# Altium project Battman.PrjPcb (part 3 of 3)

## Sheet Singlepath.SchDoc
size A4; SheetNumber: 10; SheetTotal: 10
Used 2 times, as channels PowerPath/SinglePath1, PowerPath/SinglePath2. Parts and nets are listed once, with the designators drawn on the sheet.
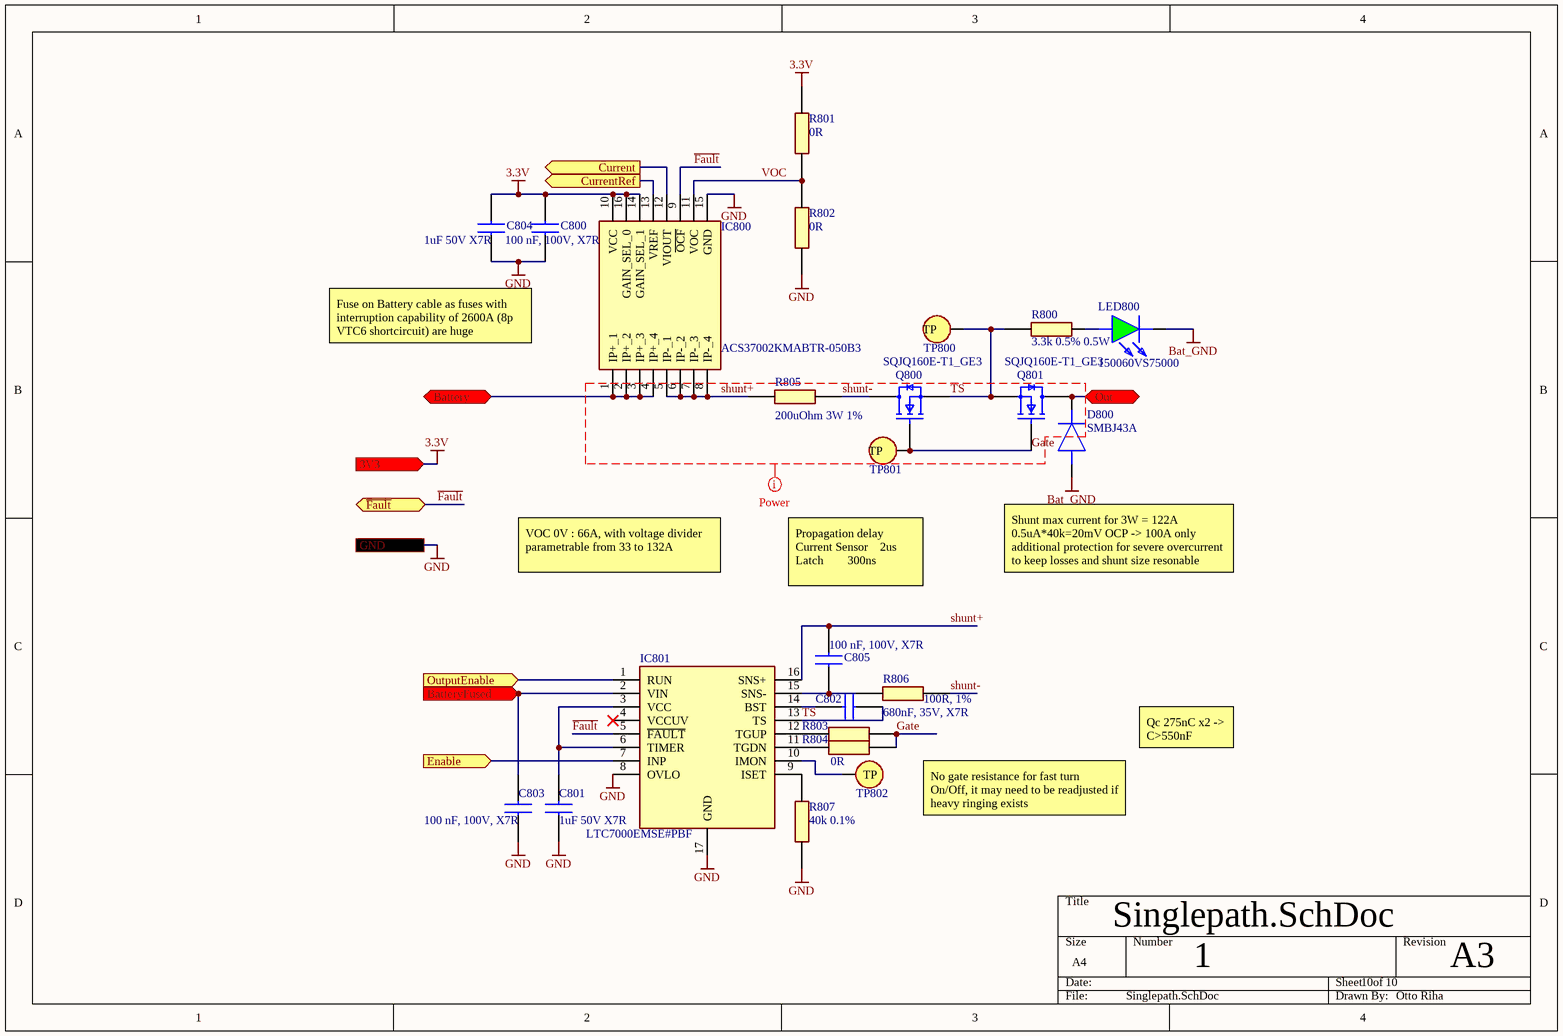
[diagram p9: Singlepath.SchDoc]

### Parts
C800  100 nF, 100V, X7R  [MAJx16]
C801  1uF 50V X7R  [CAPC1608X90N]
C802  680nF, 35V, X7R  [CAPC1608X90N]
C803  100 nF, 100V, X7R  [MAJx16]
C804  1uF 50V X7R  [CAPC1608X90N]
C805  100 nF, 100V, X7R  [MAJx16]
D800  SMBJ43A  [DIOM5436X244N]
IC800  ACS37002KMABTR-050B3  [SOIC127P1030X265-16N]
IC801  LTC7000EMSE#PBF  [SOP50P490X110-17N]
LED800  150060VS75000  [LEDC1608X80N]
Q800  SQJQ160E-T1_GE3  [SQJQ160ET1_GE3]
Q801  SQJQ160E-T1_GE3  [SQJQ160ET1_GE3]
R800  3.3k 0.5% 0.5W  [ERJP06D1000V]
R801  value 0R  [RESC1608X50N]  (hidden comment: 0Ohm)
R802  value 0R  [RESC1608X50N]  (hidden comment: 0Ohm)
R803  value 0R  [RESC1608X50N]  (hidden comment: 0Ohm)
R804  0Ohm  [RESC1608X50N]  (value not drawn)
R805  200uOhm 3W 1%  [RESC10052X63N]
R806  100R, 1%  [RESC1608X50N]
R807  40k 0.1%  [RESC1608X55N]
TP800  Testpoint  [Testpoint]  (value not drawn)
TP801  Testpoint  [Testpoint]  (value not drawn)
TP802  Testpoint  [Testpoint]  (value not drawn)

### Ports
3V3 (in, see PowerPath[2B], AuxSupply_USB[2D], MCU[1A], PowerPath[1B]), Battery (bidir, see PowerPath[2A], PowerPath[1A]), BatteryFused (in, see PowerPath[2B], PowerPath[1B]), Current (out, see PowerPath[2B]), CurrentRef (out, see PowerPath[2B]), Enable (in, see PowerPath[2B]), GND (see PowerPath[2B], AuxSupply_USB[1C], LTC_Hardware[1D], MCU[1A], PowerPath[1B]), Out (bidir, see PowerPath[2B]), OutputEnable (in, see PowerPath[2B], MCU[3C], PowerPath[2D]), ~{Fault} (bidir, see PowerPath[2B])

### Nets
3.3V: C800.2 C804.2 IC800.10(VCC) IC800.14(GAIN_SEL_1) IC800.16(GAIN_SEL_0) R801.2 ; port 3V3
Bat_GND: D800.2(A) LED800.1(K)
GND: C800.1 C801.1 C803.1 C804.1 IC800.15(GND) IC801.8(OVLO) IC801.17(GND) R802.1 R807.1 ; port GND
Battery: IC800.1(IP+_1) IC800.2(IP+_2) IC800.3(IP+_3) IC800.4(IP+_4) ; port Battery
BatteryFused: C803.2 IC801.2(VIN) ; port BatteryFused
Current: IC800.12(VIOUT) ; port Current
CurrentRef: IC800.13(VREF) ; port CurrentRef
Enable: IC801.7(INP) ; port Enable
~{Fault}: IC800.9(~{OCF}) IC801.5(~{FAULT}) ; port ~{Fault}
Gate: Q800.1(G) Q801.1(G) R803.2 R804.2 TP801.1(TP)
Out: D800.1(K) Q801.3(D_1) ; port Out
OutputEnable: IC801.1(RUN) ; port OutputEnable
shunt+: C805.2 IC800.5(IP-_1) IC800.6(IP-_2) IC800.7(IP-_3) IC800.8(IP-_4) IC801.16(SNS+) R805.1
shunt-: Q800.3(D_1) R805.2 R806.2
TS: C802.2 IC801.13(TS) Q800.2(S_1) Q801.2(S_1) R800.1 TP800.1(TP)
VOC: IC800.11(VOC) R801.1 R802.2
NetC801_2: C801.2 IC801.3(VCC) IC801.6(TIMER)
NetC802_1: C802.1 IC801.14(BST)
NetC805_1: C805.1 IC801.15(SNS-) R806.1
NetIC801_9: IC801.9(ISET) R807.2
NetIC801_10: IC801.10(IMON) TP802.1(TP)
NetIC801_11: IC801.11(TGDN) R804.1
NetIC801_12: IC801.12(TGUP) R803.1
NetLED800_2: LED800.2(A) R800.2

Not connected (* = marked no-connect by the designer): IC801 4(VCCUV)*

### Channels
PowerPath/SinglePath1: designators end in A; ports 3V3=3.3V Battery=V_Bat BatteryFused=V_Bat_Fused Current=Current1 CurrentRef=CurrRef1 Enable=Enable1 GND=Bat_GND_Fused Out=Out1 OutputEnable=OutputEnable ~{Fault}=~{Fault}
PowerPath/SinglePath2: designators end in B; ports 3V3=3.3V Battery=V_Bat BatteryFused=V_Bat_Fused Current=Current2 CurrentRef=CurrRef2 Enable=Enable2 GND=Bat_GND_Fused Out=Out2 OutputEnable=OutputEnable ~{Fault}=~{Fault}

### Layout directives
net class Batt+: Gate, shunt+, shunt-, TS

### Notes on the sheet
- Fuse on Battery cable as fuses with interruption capability of 2600A (8p VTC6 shortcircuit) are huge
- VOC 0V : 66A, with voltage divider parametrable from 33 to 132A
- Propagation delay
  Current Sensor    2us
  Latch 	      300ns
- (near D800) Shunt max current for 3W = 122A
  0.5uA*40k=20mV OCP -> 100A only additional protection for severe overcurrent to keep losses and shunt size resonable
- Qc 275nC x2 ->
  C>550nF
- No gate resistance for fast turn On/Off, it may need to be readjusted if heavy ringing exists
- 1
- A3
- Otto Riha

### Library data of the parts
C800 C803 C805 = MAJCH168BB7104KTEA01: Capacitor 100nF, 100V, X7R; Manufacturer_Name: TAIYO YUDEN; Datasheet Link: https://ds.yuden.co.jp/TYCOMPAS/or/detail?pn=MAJCH168BB7104KTEA01; Height: 0.8mm; Manufacturer_Part_Number: MAJCH168BB7104KTEA01; Mouser Part Number: 963-MAJCH168BB7104KT; Mouser Price/Stock: https://www.mouser.co.uk/ProductDetail/TAIYO-YUDEN/MAJCH168BB7104KTEA01?qs=ZcfC38r4PovaTBrG0IdezQ%3D%3D; Arrow Part Number: MAJCH168BB7104KTEA01; Arrow Price/Stock: https://www.arrow.com/en/products/majch168bb7104ktea01/taiyo-yuden?utm_currency=USD&region=nac; Supplier 1: Mouser; Supplier Part Number 1: 963-MAJCH168BB7104KT
C801 C804 = 06035C105MAT2A: Capacitor 1uF 50V X7R; Manufacturer_Name: Kyocera AVX; Datasheet Link: https://componentsearchengine.com/Datasheets/1/06031A100FAT2A.pdf; Height: 0.9mm; Manufacturer_Part_Number: 06035C105MAT2A; Mouser Part Number: 581-06035C105MAT2A; Mouser Price/Stock: https://www.mouser.co.uk/ProductDetail/KYOCERA-AVX/06035C105MAT2A?qs=%252BdQmOuGyFcHMsevPtc6OZQ%3D%3D; Value: 1uF
C802 = CGA3E1X7R1V684K080AC: Capacitor 680nF, 35V, X7R; Manufacturer_Name: TDK; Datasheet Link: http://docs-europe.electrocomponents.com/webdocs/14e9/0900766b814e9125.pdf; Height: 0.9mm; Manufacturer_Part_Number: CGA3E1X7R1V684K080AC; Mouser Part Number: 810-CGA3E1X7R1V684KC; Supplier 1: Mouser; Supplier Part Number 1: 810-CGA3E1X7R1V684KC
D800 = SMBJ43A: Diode; Manufacturer_Name: LITTELFUSE; Datasheet Link: https://componentsearchengine.com/Datasheets/2/SMBJ43A.pdf; Height: 2.44mm; Manufacturer_Part_Number: SMBJ43A; Mouser Part Number: 576-SMBJ43A; Mouser Price/Stock: https://www.mouser.co.uk/ProductDetail/Littelfuse/SMBJ43A?qs=zHiv0nsVGmoMbQaEc1ZdvQ%3D%3D; Arrow Part Number: SMBJ43A; Arrow Price/Stock: https://www.arrow.com/en/products/smbj43a/littelfuse?region=nac
IC800 = ACS37002KMABTR-050B3: Integrated Circuit; Manufacturer_Name: Allegro Microsystems; Datasheet Link: https://www.allegromicro.com/-/media/files/datasheets/acs37002-datasheet.ashx?sc_lang=en&hash=FFD236A6D18C7717C5A7906548FB48D2; Height: 2.65mm; Manufacturer_Part_Number: ACS37002KMABTR-050B3; Mouser Part Number: 250-37002KMABTR050B3; Mouser Price/Stock: https://www.mouser.co.uk/ProductDetail/Allegro-MicroSystems/ACS37002KMABTR-050B3?qs=pUKx8fyJudCSE%2FoW6XxDYQ%3D%3D
IC801 = LTC7000EMSE#PBF: Integrated Circuit; Manufacturer_Name: Analog Devices; Datasheet Link: https://www.analog.com/media/en/technical-documentation/data-sheets/ltc7000-7000-1.pdf; Height: 1.1mm; Manufacturer_Part_Number: LTC7000EMSE#PBF; Mouser Part Number: 584-LTC7000EMSEPBF; Mouser Price/Stock: https://www.mouser.co.uk/ProductDetail/Analog-Devices/LTC7000EMSEPBF?qs=BZBei1rCqCABaEvAxqf5Sw%3D%3D; Arrow Part Number: LTC7000EMSE#PBF; Arrow Price/Stock: https://www.arrow.com/en/products/ltc7000emsepbf/analog-devices?region=nac
LED800 = 150060VS75000: LED; Manufacturer_Name: Wurth Elektronik; Datasheet Link: https://componentsearchengine.com/Datasheets/2/150060VS75000.pdf; Height: 0.8mm; Manufacturer_Part_Number: 150060VS75000; Mouser Part Number: 710-150060VS75000; Mouser Price/Stock: https://www.mouser.co.uk/ProductDetail/Wurth-Elektronik/150060VS75000?qs=LlUlMxKIyB1Q1Bi5mQ%2FKLw%3D%3D
Q800 Q801 = SQJQ160E-T1_GE3: MOSFET (N-Channel); Manufacturer_Name: Vishay; Datasheet Link: https://www.vishay.com/docs/63059/sqjq160e.pdf; Height: 1.65mm; Manufacturer_Part_Number: SQJQ160E-T1_GE3; Mouser Part Number: 78-SQJQ160E-T1_GE3; Mouser Price/Stock: https://www.mouser.co.uk/ProductDetail/Vishay-Semiconductors/SQJQ160E-T1_GE3?qs=Wj%2FVkw3K%252BMDBWZlqh0rWDw%3D%3D
R800 = ERJ-P06J332V: Resistor; Manufacturer_Name: Panasonic; Datasheet Link: http://industrial.panasonic.com/cdbs/www-data/pdf/RDA0000/AOA0000C102.pdf; Height: 0.7mm; Manufacturer_Part_Number: ERJ-P06J332V; Mouser Part Number: 667-ERJ-P06J332V; Mouser Price/Stock: https://www.mouser.co.uk/ProductDetail/Panasonic/ERJ-P06J332V?qs=Zyl8A9hlmJrue%2FwxovXuCg%3D%3D; Arrow Part Number: ERJ-P06J332V; Arrow Price/Stock: https://www.arrow.com/en/products/erj-p06j332v/panasonic
R801-R803 = CRCW06030000Z0EC: Resistor; Manufacturer_Name: Vishay; Datasheet Link: http://www.vishay.com/docs/20035/dcrcwe3.pdf; Height: 0.5mm; Manufacturer_Part_Number: CRCW06030000Z0EC; Mouser Part Number: 71-CRCW06030000Z0EC; Mouser Price/Stock: https://www.mouser.co.uk/ProductDetail/Vishay-Dale/CRCW06030000Z0EC?qs=5Vo7YKalRVV5nT3RQodYAA%3D%3D; Arrow Part Number: CRCW06030000Z0EC; Arrow Price/Stock: https://www.arrow.com/en/products/crcw06030000z0ec/vishay?utm_currency=USD&region=nac
R804 = CRCW06030000Z0EC: Resistor; Manufacturer_Name: Vishay; Value: 0R; Datasheet Link: http://www.vishay.com/docs/20035/dcrcwe3.pdf; Height: 0.5mm; Manufacturer_Part_Number: CRCW06030000Z0EC; Mouser Part Number: 71-CRCW06030000Z0EC; Mouser Price/Stock: https://www.mouser.co.uk/ProductDetail/Vishay-Dale/CRCW06030000Z0EC?qs=5Vo7YKalRVV5nT3RQodYAA%3D%3D; Arrow Part Number: CRCW06030000Z0EC; Arrow Price/Stock: https://www.arrow.com/en/products/crcw06030000z0ec/vishay?utm_currency=USD&region=nac
R805 = PU3921FKN130U2L: Resistor; Manufacturer_Name: YAGEO; Datasheet Link: https://www.yageo.com/upload/media/product/app/datasheet/rchip/pyu-pu_51_rohs_l.pdf; Height: 0.63mm; Manufacturer_Part_Number: PU3921FKN130U2L; Mouser Part Number: 603-PU3921FKN130U2L; Mouser Price/Stock: https://www.mouser.co.uk/ProductDetail/YAGEO/PU3921FKN130U2L?qs=Yv%2FzsQ5pz3Hao%2Fr%2FiAcpvw%3D%3D; Arrow Part Number: PU3921FKN130U2L; Arrow Price/Stock: https://www.arrow.com/en/products/pu3921fkn130u2l/yageo?utm_currency=USD&region=nac
R806 = CRCW0603100RFKEA: Resistor 100R, 1%; Manufacturer_Name: Vishay; Datasheet Link: http://www.vishay.com/docs/20035/dcrcwe3.pdf; Height: 0.5mm; Manufacturer_Part_Number: CRCW0603100RFKEA; Mouser Part Number: 71-CRCW0603-100-E3; Mouser Price/Stock: https://www.mouser.co.uk/ProductDetail/Vishay-Dale/CRCW0603100RFKEA?qs=90AHS1y%2FsidGWjjxZAupKg%3D%3D; Arrow Part Number: CRCW0603100RFKEA; Arrow Price/Stock: https://www.arrow.com/en/products/crcw0603100rfkea/vishay?utm_currency=USD&region=europe; Supplier 1: Mouser; Supplier Part Number 1: 71-CRCW0603-100-E3; Value: 100R
R807 = AT0603BRD0740KL: Resistor; Manufacturer_Name: YAGEO; Datasheet Link: https://pt.mouser.com/datasheet/2/447/PYu_AT_51_RoHS_L_6-3003058.pdf; Height: 0.55mm; Manufacturer_Part_Number: AT0603BRD0740KL; Mouser Part Number: 603-AT0603BRD0740KL

## Nets that join several sheets
3.3V: Main (J11.2), AuxSupply_USB (11 pins), MCU (16 pins), PowerPath (C900.1 IC900.8 R900.1), PowerPath/SinglePath1 (6 pins), PowerPath/SinglePath2 (6 pins)
5V: AuxSupply_USB (C418.2 PS401.7 PS401.8_9 TP407.1), MCU (C709.2 C710.2 IC701.8)
5V_USB: Main (J10.A4_B9 J10.B4_A9), AuxSupply_USB (9 pins)
Bat_GND: Main (12 pins), PowerPath/SinglePath1 (D800A.2 LED800A.1), PowerPath/SinglePath2 (D800B.2 LED800B.1)
Bat_GND_Fused: Main (6 pins), LTC_Hardware (5 pins), AuxSupply_USB (31 pins), LTC_Soft (12 pins), MCU (33 pins), PowerPath (C900.2 IC900.1 IC900.2 IC900.4), PowerPath/SinglePath1 (9 pins), PowerPath/SinglePath2 (9 pins)
CAN_GND: Main (J8.3 J8.4 J9.3 J9.4), AuxSupply_USB (C418.1 PS401.10_11 PS401.12 TP408.1), MCU (5 pins)
Cell0: cell_inputfilter (F100.2), CellFilter/CellFilter1 (5 pins), CellFilter/CellFilter2 (C200B.1 C201B.1), CellFilter/CellFilter3 (C200C.1 C201C.1), CellFilter/CellFilter4 (C200D.1 C201D.1), CellFilter/CellFilter5 (C200E.1 C201E.1), CellFilter/CellFilter6 (C200F.1 C201F.1), CellFilter/CellFilter7 (C200G.1 C201G.1), CellFilter/CellFilter8 (C200H.1 C201H.1), CellFilter/CellFilter9 (C200I.1 C201I.1), CellFilter/CellFilter10 (C200J.1 C201J.1), LTC_Hardware (5 pins), Hardware Protection/Multiplexer1 (C500A.1 IC500A.3 IC500A.7 JS502A.1), Hardware Protection/Multiplexer2 (C500B.1 IC500B.3 IC500B.7 JS502B.1), Hardware Protection/Multiplexer3 (C500C.1 IC500C.3 IC500C.7 JS502C.1), Hardware Protection/Multiplexer4 (C500D.1 IC500D.3 IC500D.7 JS502D.1), Hardware Protection/Multiplexer5 (C500E.1 IC500E.3 IC500E.7 JS502E.1), Hardware Protection/Multiplexer6 (C500F.1 IC500F.3 IC500F.7 JS502F.1), Hardware Protection/Multiplexer7 (C500G.1 IC500G.3 IC500G.7 JS502G.1), Hardware Protection/Multiplexer8 (C500H.1 IC500H.3 IC500H.7 JS502H.1), LTC_Soft (IC600.26)
USB_GND: Main (8 pins), AuxSupply_USB (11 pins)
V_Bat: Main (F1.1 J1.2), PowerPath/SinglePath1 (IC800A.1 IC800A.2 IC800A.3 IC800A.4), PowerPath/SinglePath2 (IC800B.1 IC800B.2 IC800B.3 IC800B.4)
V_Bat_Fused: Main (F1.2 TP1.1), LTC_Hardware (R303.1), AuxSupply_USB (R402.2 R404.2), LTC_Soft (R600.1 R604.1), PowerPath/SinglePath1 (C803A.2 IC801A.2), PowerPath/SinglePath2 (C803B.2 IC801B.2)
VrefH: LTC_Hardware (5 pins), Hardware Protection/Multiplexer1 (IC500A.4 JS501A.1), Hardware Protection/Multiplexer2 (IC500B.4 JS501B.1), Hardware Protection/Multiplexer3 (IC500C.4 JS501C.1), Hardware Protection/Multiplexer4 (IC500D.4 JS501D.1), Hardware Protection/Multiplexer5 (IC500E.4 JS501E.1), Hardware Protection/Multiplexer6 (IC500F.4 JS501F.1), Hardware Protection/Multiplexer7 (IC500G.4 JS501G.1), Hardware Protection/Multiplexer8 (IC500H.4 JS501H.1)
Vreg: LTC_Hardware (8 pins), Hardware Protection/Multiplexer1 (5 pins), Hardware Protection/Multiplexer2 (5 pins), Hardware Protection/Multiplexer3 (5 pins), Hardware Protection/Multiplexer4 (5 pins), Hardware Protection/Multiplexer5 (5 pins), Hardware Protection/Multiplexer6 (5 pins), Hardware Protection/Multiplexer7 (5 pins), Hardware Protection/Multiplexer8 (5 pins)
A0_1: Hardware Protection/Multiplexer1 (IC500A.1), MCU (IC700#2.40)
A0_2: Hardware Protection/Multiplexer2 (IC500B.1), MCU (IC700#2.52)
A0_3: Hardware Protection/Multiplexer3 (IC500C.1), MCU (IC700#2.53)
A0_4: Hardware Protection/Multiplexer4 (IC500D.1), MCU (IC700#2.54)
A0_5: Hardware Protection/Multiplexer5 (IC500E.1), MCU (IC700#2.56)
A0_6: Hardware Protection/Multiplexer6 (IC500F.1), MCU (IC700#2.58)
A0_7: Hardware Protection/Multiplexer7 (IC500G.1), MCU (IC700#2.59)
A0_8: Hardware Protection/Multiplexer8 (IC500H.1), MCU (IC700#2.6)
A1_1: Hardware Protection/Multiplexer1 (IC500A.10), MCU (IC700#2.39)
A1_2: Hardware Protection/Multiplexer2 (IC500B.10), MCU (IC700#2.41)
A1_3: Hardware Protection/Multiplexer3 (IC500C.10), MCU (IC700#2.42)
A1_4: Hardware Protection/Multiplexer4 (IC500D.10), MCU (IC700#2.43)
A1_5: Hardware Protection/Multiplexer5 (IC500E.10), MCU (IC700#2.51)
A1_6: Hardware Protection/Multiplexer6 (IC500F.10), MCU (IC700#2.57)
A1_7: Hardware Protection/Multiplexer7 (IC500G.10), MCU (IC700#2.2)
A1_8: Hardware Protection/Multiplexer8 (IC500H.10), MCU (IC700#2.5)
CAN_N: Main (J8.2 J9.2), MCU (D700.2 FL700.3 S703.2)
CAN_P: Main (J8.1 J9.1), MCU (D700.1 FL700.4 S703.5)
Cell1: Main (J7.10), CellFilter/CellFilter1 (F200A.1)
Cell2: Main (J7.9), CellFilter/CellFilter2 (F200B.1)
Cell3: Main (J7.8), CellFilter/CellFilter3 (F200C.1)
Cell4: Main (J7.7), CellFilter/CellFilter4 (F200D.1)
Cell5: Main (J7.6), CellFilter/CellFilter5 (F200E.1)
Cell6: Main (J7.5), CellFilter/CellFilter6 (F200F.1)
Cell7: Main (J7.4), CellFilter/CellFilter7 (F200G.1)
Cell8: Main (J7.3), CellFilter/CellFilter8 (F200H.1)
Cell9: Main (J7.2), CellFilter/CellFilter9 (F200I.1)
Cell10: Main (J7.1), CellFilter/CellFilter10 (F200J.1)
Current1: MCU (IC700#2.10), PowerPath/SinglePath1 (IC800A.12)
Current2: MCU (IC700#2.16), PowerPath/SinglePath2 (IC800B.12)
CurrRef1: MCU (IC700#2.11), PowerPath/SinglePath1 (IC800A.13)
CurrRef2: MCU (IC700#2.17), PowerPath/SinglePath2 (IC800B.13)
Enable1: MCU (IC700#2.24), PowerPath/SinglePath1 (IC801A.7)
Enable2: MCU (IC700#2.26), PowerPath/SinglePath2 (IC801B.7)
~{Fault}: LTC_Hardware (IC301.7 TP312.1), MCU (IC700#2.9), PowerPath (IC900.6 R900.2), PowerPath/SinglePath1 (IC800A.9 IC801A.5), PowerPath/SinglePath2 (IC800B.9 IC801B.5)
LTC_H_C1: CellFilter/CellFilter1 (C200A.2 R200A.2 Z200A.1), CellFilter/CellFilter2 (Z200B.2), LTC_Hardware (IC300.13)
LTC_H_C2: CellFilter/CellFilter2 (C200B.2 R200B.2 Z200B.1), CellFilter/CellFilter3 (Z200C.2), LTC_Hardware (IC300.12)
LTC_H_C3: CellFilter/CellFilter3 (C200C.2 R200C.2 Z200C.1), CellFilter/CellFilter4 (Z200D.2), LTC_Hardware (IC300.11)
LTC_H_C4: CellFilter/CellFilter4 (C200D.2 R200D.2 Z200D.1), CellFilter/CellFilter5 (Z200E.2), LTC_Hardware (IC300.10)
LTC_H_C5: CellFilter/CellFilter5 (C200E.2 R200E.2 Z200E.1), CellFilter/CellFilter6 (Z200F.2), LTC_Hardware (IC300.9)
LTC_H_C6: CellFilter/CellFilter6 (C200F.2 R200F.2 Z200F.1), CellFilter/CellFilter7 (Z200G.2), LTC_Hardware (IC300.8)
LTC_H_C7: CellFilter/CellFilter7 (C200G.2 R200G.2 Z200G.1), CellFilter/CellFilter8 (Z200H.2), LTC_Hardware (IC300.7)
LTC_H_C8: CellFilter/CellFilter8 (C200H.2 R200H.2 Z200H.1), CellFilter/CellFilter9 (Z200I.2), LTC_Hardware (IC300.6)
LTC_H_C9: CellFilter/CellFilter9 (C200I.2 R200I.2 Z200I.1), CellFilter/CellFilter10 (Z200J.2), LTC_Hardware (IC300.5)
LTC_H_C10: CellFilter/CellFilter10 (C200J.2 R200J.2 Z200J.1), LTC_Hardware (IC300.2 IC300.3 IC300.4)
LTC_S_C1: CellFilter/CellFilter1 (C201A.2 R201A.2 Z201A.1), CellFilter/CellFilter2 (Z201B.2), LTC_Soft (IC600.24)
LTC_S_C2: CellFilter/CellFilter2 (C201B.2 R201B.2 Z201B.1), CellFilter/CellFilter3 (Z201C.2), LTC_Soft (IC600.22)
LTC_S_C3: CellFilter/CellFilter3 (C201C.2 R201C.2 Z201C.1), CellFilter/CellFilter4 (Z201D.2), LTC_Soft (IC600.20)
LTC_S_C4: CellFilter/CellFilter4 (C201D.2 R201D.2 Z201D.1), CellFilter/CellFilter5 (Z201E.2), LTC_Soft (IC600.18)
LTC_S_C5: CellFilter/CellFilter5 (C201E.2 R201E.2 Z201E.1), CellFilter/CellFilter6 (Z201F.2), LTC_Soft (IC600.16)
LTC_S_C6: CellFilter/CellFilter6 (C201F.2 R201F.2 Z201F.1), CellFilter/CellFilter7 (Z201G.2), LTC_Soft (IC600.14)
LTC_S_C7: CellFilter/CellFilter7 (C201G.2 R201G.2 Z201G.1), CellFilter/CellFilter8 (Z201H.2), LTC_Soft (IC600.12)
LTC_S_C8: CellFilter/CellFilter8 (C201H.2 R201H.2 Z201H.1), CellFilter/CellFilter9 (Z201I.2), LTC_Soft (IC600.10)
LTC_S_C9: CellFilter/CellFilter9 (C201I.2 R201I.2 Z201I.1), CellFilter/CellFilter10 (Z201J.2), LTC_Soft (IC600.8)
LTC_S_C10: CellFilter/CellFilter10 (C201J.2 R201J.2 Z201J.1), LTC_Soft (IC600.2 IC600.4 IC600.6)
LTC_S_S1: CellFilter/CellFilter1 (R202A.2), LTC_Soft (IC600.25)
LTC_S_S2: CellFilter/CellFilter2 (R202B.2), LTC_Soft (IC600.23)
LTC_S_S3: CellFilter/CellFilter3 (R202C.2), LTC_Soft (IC600.21)
LTC_S_S4: CellFilter/CellFilter4 (R202D.2), LTC_Soft (IC600.19)
LTC_S_S5: CellFilter/CellFilter5 (R202E.2), LTC_Soft (IC600.17)
LTC_S_S6: CellFilter/CellFilter6 (R202F.2), LTC_Soft (IC600.15)
LTC_S_S7: CellFilter/CellFilter7 (R202G.2), LTC_Soft (IC600.13)
LTC_S_S8: CellFilter/CellFilter8 (R202H.2), LTC_Soft (IC600.11)
LTC_S_S9: CellFilter/CellFilter9 (R202I.2), LTC_Soft (IC600.9)
LTC_S_S10: CellFilter/CellFilter10 (R202J.2), LTC_Soft (IC600.7)
Mult1: LTC_Hardware (IC300.36 TP309.1), Hardware Protection/Multiplexer1 (IC500A.8)
Mult2: LTC_Hardware (IC300.35 TP308.1), Hardware Protection/Multiplexer2 (IC500B.8)
Mult3: LTC_Hardware (IC300.34 TP307.1), Hardware Protection/Multiplexer3 (IC500C.8)
Mult4: LTC_Hardware (IC300.33 TP306.1), Hardware Protection/Multiplexer4 (IC500D.8)
Mult5: LTC_Hardware (IC300.32 TP305.1), Hardware Protection/Multiplexer5 (IC500E.8)
Mult6: LTC_Hardware (IC300.31 TP304.1), Hardware Protection/Multiplexer6 (IC500F.8)
Mult7: LTC_Hardware (IC300.30 TP303.1), Hardware Protection/Multiplexer7 (IC500G.8)
Mult8: LTC_Hardware (IC300.27 TP302.1), Hardware Protection/Multiplexer8 (IC500H.8)
NetF100_1: Main (J7.11), cell_inputfilter (F100.1)
NetF200A_2: CellFilter/CellFilter1 (F200A.2 Q200A.2 R200A.1 R201A.1), CellFilter/CellFilter2 (R203B.1)
NetF200B_2: CellFilter/CellFilter2 (F200B.2 Q200B.2 R200B.1 R201B.1), CellFilter/CellFilter3 (R203C.1)
NetF200C_2: CellFilter/CellFilter3 (F200C.2 Q200C.2 R200C.1 R201C.1), CellFilter/CellFilter4 (R203D.1)
NetF200D_2: CellFilter/CellFilter4 (F200D.2 Q200D.2 R200D.1 R201D.1), CellFilter/CellFilter5 (R203E.1)
NetF200E_2: CellFilter/CellFilter5 (F200E.2 Q200E.2 R200E.1 R201E.1), CellFilter/CellFilter6 (R203F.1)
NetF200F_2: CellFilter/CellFilter6 (F200F.2 Q200F.2 R200F.1 R201F.1), CellFilter/CellFilter7 (R203G.1)
NetF200G_2: CellFilter/CellFilter7 (F200G.2 Q200G.2 R200G.1 R201G.1), CellFilter/CellFilter8 (R203H.1)
NetF200H_2: CellFilter/CellFilter8 (F200H.2 Q200H.2 R200H.1 R201H.1), CellFilter/CellFilter9 (R203I.1)
NetF200I_2: CellFilter/CellFilter9 (F200I.2 Q200I.2 R200I.1 R201I.1), CellFilter/CellFilter10 (R203J.1)
NetIC300_20: LTC_Hardware (IC300.20 TP310.1), MCU (IC700#2.8)
NetIC300_28: LTC_Hardware (IC300.28), MCU (IC700#2.14)
NetIC300_29: LTC_Hardware (IC300.29), MCU (IC700#2.15)
NetIC600_41: LTC_Soft (IC600.41 TP606.1), MCU (IC700#2.20)
NetIC600_42: LTC_Soft (IC600.42 TP605.1), MCU (IC700#2.21)
NetIC600_43: LTC_Soft (IC600.43 TP604.1), MCU (IC700#2.23)
NetIC600_44: LTC_Soft (IC600.44 TP603.1), MCU (IC700#2.22 R711.2)
NetIC700#2_27: MCU (IC700#2.27), PowerPath (IC900.7)
Out1: Main (J2.2), PowerPath/SinglePath1 (D800A.1 Q801A.3)
Out2: Main (J4.1), PowerPath/SinglePath2 (D800B.1 Q801B.3)
OutputEnable: MCU (IC700#2.25), PowerPath (IC900.5 TP900.1), PowerPath/SinglePath1 (IC801A.1), PowerPath/SinglePath2 (IC801B.1)
Temp1: Main (J3.1), LTC_Soft (IC600.27 R603.2)
Temp2: Main (J5.1), LTC_Soft (IC600.28 R602.2)
Temp3: Main (J6.1), LTC_Soft (IC600.29 R601.2)
USB_D_N: Main (J10.A7 J10.B7), AuxSupply_USB (D401.3 IC403.6)
USB_D_P: Main (J10.A6 J10.B6), AuxSupply_USB (D401.2 IC403.7)
USB_ISO_N: AuxSupply_USB (IC403.11), MCU (IC700#2.44)
USB_ISO_P: AuxSupply_USB (IC403.10), MCU (IC700#2.45)